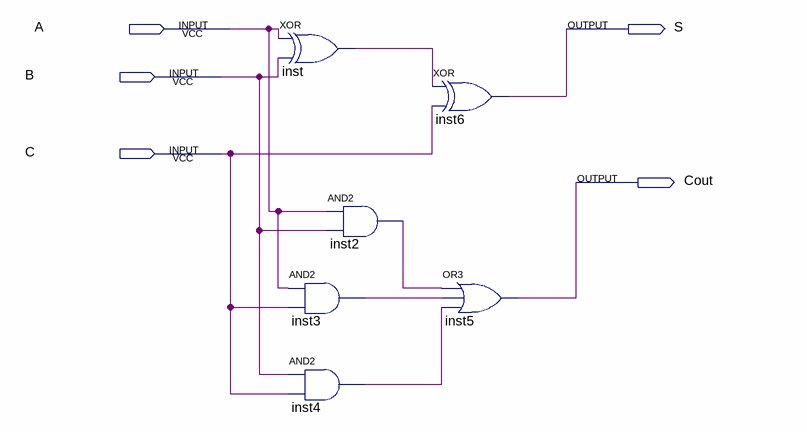
[diagram p0: schematic sheet]
// Quartus schematic FullAdder.bdf as structural Verilog: 6 symbols, 5 pins
module FullAdder (
  input  A,
  input  B,
  input  C,
  output S,
  output Cout
);

  wire inst2_out, inst3_out, inst4_out, inst_out;

  xor inst (inst_out, A, B);
  and inst3 (inst3_out, A, C);
  and inst4 (inst4_out, B, C);
  and inst2 (inst2_out, A, B);
  xor inst6 (S, inst_out, C);
  or inst5 (Cout, inst2_out, inst3_out, inst4_out);
endmodule
